# Altium schematic sheet MCU STM8 STM8S103K3U6.SchDoc
size 209 x 297 mm; PartName: Контроллер; Date: 03.03.2017; Author: Мурашкин Д.В.; CompanyName: Smart Shelf Eurasia; DrawnBy: Мурашкин; Address1: Address1; Address2: Address2; Address3: Address3; Address4: Address4; DocumentNumber: SS19946-COSHP-R03-02; SheetNumber: 2; SheetTotal: 3; Scale: -; Letter1Column: Э; CurrentDate: 03.03.2017
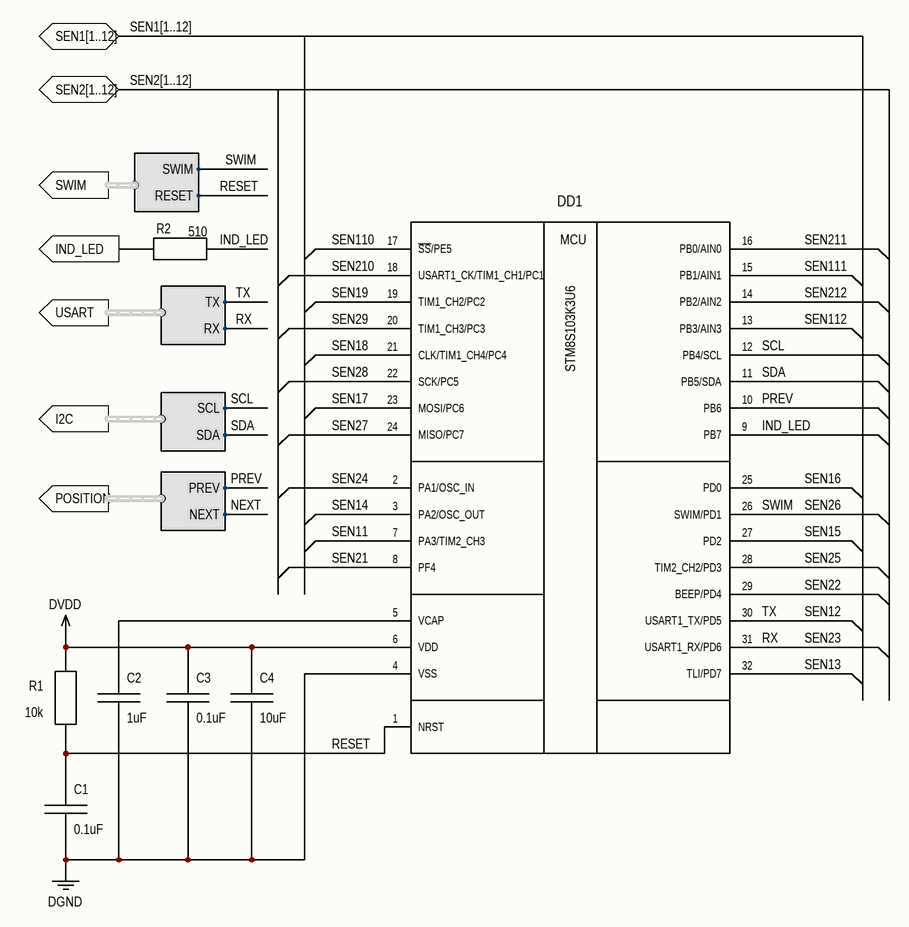
[diagram p0: MCU STM8 STM8S103K3U6.SchDoc]

## Parts
C1  0.1uF  [CAPC1608L]
C2  1uF  [CAPC1608L]
C3  0.1uF  [CAPC1608L]
C4  10uF  [CAPC2012L]
DD1  STM8S103K3U6  [UFQFPN-32]
R1  10k  [RESC1608L]
R2  510  [RESC1608L]

## Ports
I2C (harness I2C), IND_LED (out), POSITION (harness POSITION), SEN1[1..12] (bidir), SEN2[1..12] (bidir), SWIM (harness SWIM), USART (harness USART)

## Harnesses
USART: RX, TX
I2C: SDA, SCL
SWIM: SWIM, RESET
POSITION: NEXT, PREV

## Nets
DGND: C1.2 C2.2 C3.2 C4.2 DD1.4(VSS)
DVDD: C3.1 C4.1 DD1.6(VDD) R1.1
IND_LED: DD1.9(PB7) R2.2
IND_LED: R2.1 ; port IND_LED  [a separate net that carries the same name]
NEXT: port POSITION.NEXT
PREV: DD1.10(PB6) ; port POSITION.PREV
RESET: C1.1 DD1.1(NRST) R1.2 ; port SWIM.RESET
RX: DD1.31(USART1_RX/PD6) ; port USART.RX  [also labelled SEN23]
SCL: DD1.12(PB4/SCL) ; port I2C.SCL
SDA: DD1.11(PB5/SDA) ; port I2C.SDA
SEN11: DD1.7(PA3/TIM2_CH3)
SEN12: DD1.30(USART1_TX/PD5) ; port USART.TX  [also labelled TX]
SEN13: DD1.32(TLI/PD7)
SEN14: DD1.3(PA2/OSC_OUT)
SEN15: DD1.27(PD2)
SEN16: DD1.25(PD0)
SEN17: DD1.23(MOSI/PC6)
SEN18: DD1.21(CLK/TIM1_CH4/PC4)
SEN19: DD1.19(TIM1_CH2/PC2)
SEN21: DD1.8(PF4)
SEN22: DD1.29(BEEP/PD4)
SEN24: DD1.2(PA1/OSC_IN)
SEN25: DD1.28(TIM2_CH2/PD3)
SEN26: DD1.26(SWIM/PD1) ; port SWIM.SWIM  [also labelled SWIM]
SEN27: DD1.24(MISO/PC7)
SEN28: DD1.22(SCK/PC5)
SEN29: DD1.20(TIM1_CH3/PC3)
SEN110: DD1.17(~{SS}/PE5)
SEN111: DD1.15(PB1/AIN1)
SEN112: DD1.13(PB3/AIN3)
SEN210: DD1.18(USART1_CK/TIM1_CH1/PC1)
SEN211: DD1.16(PB0/AIN0)
SEN212: DD1.14(PB2/AIN2)
NetC2_1: C2.1 DD1.5(VCAP)

## Buses and harness runs
bus SEN1[1..12] = port SEN1[1..12]
bus SEN2[1..12] = port SEN2[1..12]

## Notes on the sheet
- Перв. примен.
- Справ. №
- Подп. и дата
- Инв. № дубл.
- Взам. инв. №
- Разраб.
- Изм.
- Лист
- № докум.
- Подп.
- Дата
- Лит.
- Масса
- Масштаб
- Пров.
- Т.контр.
- Листов
- Инв. № подл.
- Утв.
- Н.контр.
- 2.106-A4
- Копировал
- Формат А4
- (in symbol STM8S103K3U6) MCU

## Library data of the parts
C1 C3 = CC0603KRX7R8BB104: Capacitor Ceramic 0.1uF 25V; Manufacturer: Yageo; Group: Ceramic Capacitors; Temperature Coefficient: X7R; Tolerance: ±10%; Short description: CAP CER 0.1UF 25V X7R 0603; Type: Ceramic; Part name: CC0603KRX7R8BB104; Voltage: 25 V; Package: 1608; Value: 0.1uF
C2 = CC0603KRX5R8BB105: Capacitor Ceramic 1uF 25V; Manufacturer: Yageo; Group: Ceramic Capacitors; Temperature Coefficient: X5R; Tolerance: ±10%; Short description: CAP CER 1UF 25V X5R 0603; Type: Ceramic; Part name: CC0603KRX5R8BB105; Voltage: 25V; Package: 1608; Value: 1uF
C4 = CC0805KKX5R8BB106: Capacitor Ceramic 10uF 25V; Manufacturer: Yageo; Group: Ceramic Capacitors; Temperature Coefficient: X5R; Tolerance: ±10%; Short description: CAP CER 10UF 25V X5R 0805; Type: Ceramic; Part name: CC0805KKX5R8BB106; Voltage: 25V; Package: 2012; Value: 10uF
DD1 = STM8S103K3U6: MCU STM8S; Manufacturer: STMicroelectronics; Group: Embeded microcontroller; Short description: IC MCU 8BIT 8KB FLASH UFQFPN32; Package: UFQFPN-32; Part name: STM8S103K3U6
R1 = RC0603JR-0710KL: Resistor Ceramic 10k 1608; Manufacturer: Yageo; Group: Resistors; Temperature Coefficient: ±100ppm/°C; Tolerance: ±5%; Voltage: 75 V; Power: 0.1W; Short description: RES SMD 10K OHM 5% 1/10W 0603; Part name: RC0603JR-0710KL; Type: Thin Film; Package: 1608; Value: 10k
R2 = RC0603JR-07510RL: Resistor Ceramic 510 1608; Manufacturer: Yageo; Group: Resistors; Temperature Coefficient: ±100ppm/°C; Tolerance: ±5%; Power: 0.1W; Short description: RES SMD 510 OHM 5% 1/10W 0603; Part name: RC0603JR-07510RL; Type: Thin Film; Package: 1608; Value: 510